# EAGLE schematic EEZ PSU consolidated r5B13a (EAGLE 6.1), part 2 of 2
## Sheet 11 of 12: Reset, load temp, digital input
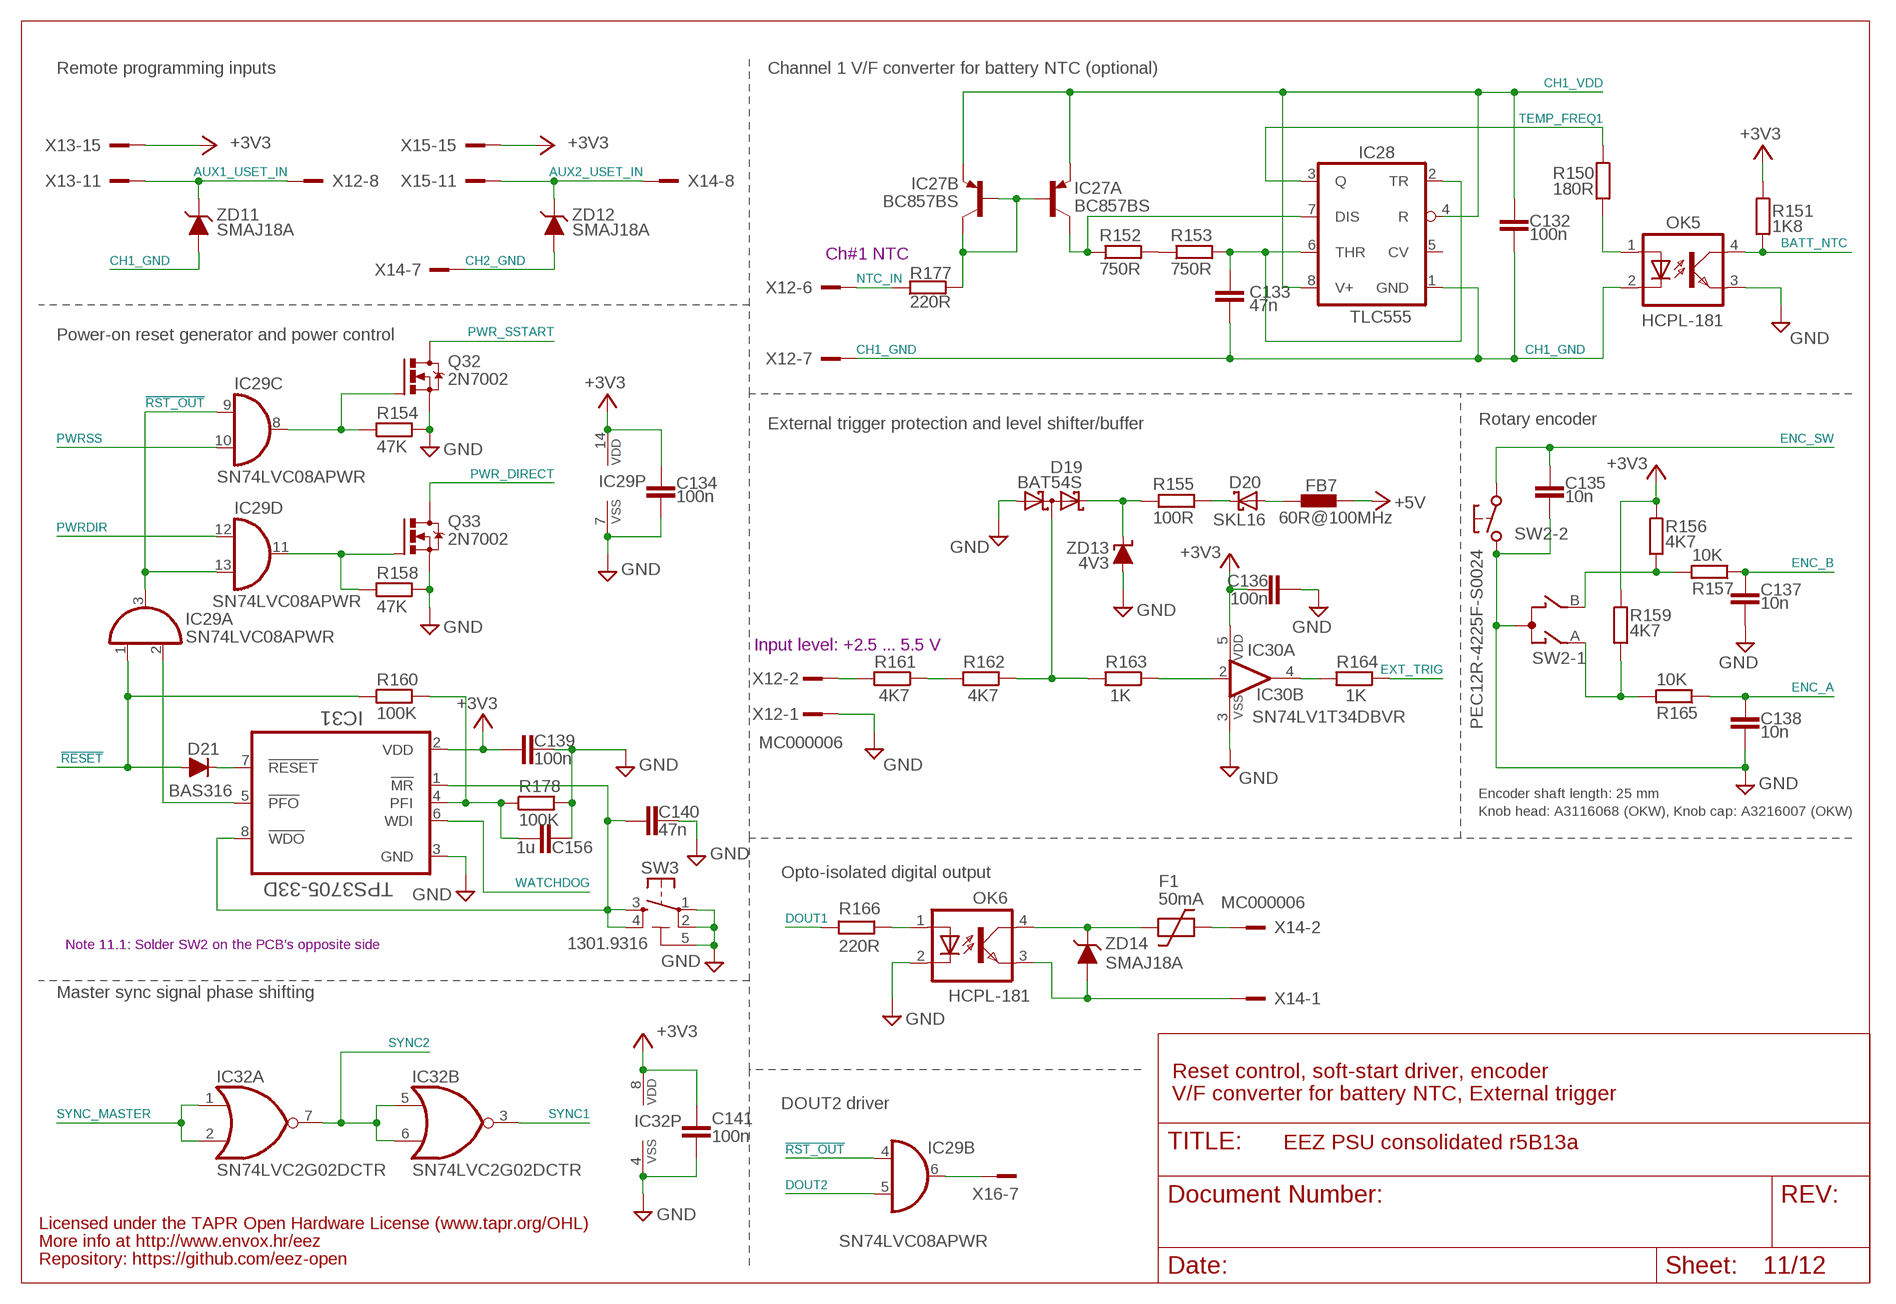
[diagram p10: schematic, sheet 11]

### Parts
C132  100n  C-EUC0603  [C0603]
C133  47n  C-EUC0805  [C0805]
C134  100n  C-EUC0603  [C0603]
C135  10n  C-EUC0805  [C0805]
C136  100n  C-EUC0603  [C0603]
C137  10n  C-EUC0805  [C0805]
C138  10n  C-EUC0805  [C0805]
C139  100n  C-EUC0603  [C0603]
C140  47n  C-EUC0805  [C0805]
C141  100n  C-EUC0603  [C0603]
C156  1u  C-EUC0805  [C0805]
D19  BAT54S  [SOT23]
D20  SKL16  SCHOTTKYSOD123  [SOD123]
D21  BAS316  DIODESOD323R  [SOD323-R]
F1  50mA  FUSE_RESETTABLE21210  [F1210]
FB7  60R@100MHz  FERRITE_BEAD0603  [BEAD0603]
IC27  BC857BS  [SOT65P210X110-6N]
IC28  TLC555  LM555SOIC8  [SOIC127P600X175-8N]
IC29  SN74LVC08APWR  [SOP65P640X120-14N]
IC30  SN74LV1T34DBVR  SN74LV1T34  [SOT95P280X145-5N]
IC31  TPS3705-33D  TPS3705XX  [SOIC127P600X175-8N]
IC32  SN74LVC2G02DCTR  [SOP65P400X130-8N]
OK5  HCPL-181  [HCPL-181]
OK6  HCPL-181  [HCPL-181]
Q32  2N7002  [SOT103P240X110-3N]
Q33  2N7002  [SOT103P240X110-3N]
R150  180R  R-EU_R0805  [R0805]
R151  1K8  R-EU_R0805  [R0805]
R152  750R  R-EU_R0805  [R0805]
R153  750R  R-EU_R0805  [R0805]
R154  47K  R-EU_R0805  [R0805]
R155  100R  R-EU_R0805  [R0805]
R156  4K7  R-EU_R0805  [R0805]
R157  10K  R-EU_R0805  [R0805]
R158  47K  R-EU_R0805  [R0805]
R159  4K7  R-EU_R0805  [R0805]
R160  100K  R-EU_R0805  [R0805]
R161  4K7  R-EU_R0805  [R0805]
R162  4K7  R-EU_R0805  [R0805]
R163  1K  R-EU_R0805  [R0805]
R164  1K  R-EU_R0805  [R0805]
R165  10K  R-EU_R0805  [R0805]
R166  220R  R-EU_R0805  [R0805]
R177  220R  R-EU_R0805  [R0805]
R178  100K  R-EU_R0805  [R0805]
SW2  PEC12R-4225F-S0024  ENCODER_SW  [EC12E_SW]
SW3  1301.9316  TACT_SW  [TACTM-6XN]
ZD11  SMAJ18A  PSMAXX  [DO214AC]
ZD12  SMAJ18A  PSMAXX  [DO214AC]
ZD13  4V3  ZENER-DIODEMINIMELF  [MINIMELF]
ZD14  SMAJ18A  PSMAXX  [DO214AC]

### Nets
!MR: C140.2 IC31.1(!MR) IC31.8(!WDO) SW3.3 SW3.4
!RESET: D21.A IC29.1(A:I0) R160.1 ; also sheet 9,10
!RST_OUT: IC29.3(A:O) IC29.4(B:I0) IC29.9(C:I0) IC29.13(D:I1)
+3V3: C134.2 C136.1 C139.2 C141.1 IC29.14(P:VDD) IC30.5(B:VDD) IC31.2(VDD) IC32.8(P:VDD) R151.1 R156.1 R159.1 X13.15 X15.15 ; also sheet 8,9,10,12
+5V: FB7.P$1 ; also sheet 2,3,4,5,6,7,8,9,10
AUX1_USET_IN: X12.8 X12.8.1 X13.11 ZD11.C
AUX2_USET_IN: X14.8 X14.8.1 X15.11 ZD12.C
BATT_NTC: OK5.4(COL) R151.2 ; also sheet 9
CH1_GND: C132.2 C133.1 IC28.1(GND) OK5.2(C) X12.7 X12.7.1 ZD11.A ; also sheet 9
CH1_VDD: C132.1 IC27.1(A:E) IC27.4(B:E) IC28.4(R) IC28.8(V+) ; also sheet 9
CH2_GND: X14.7 X14.7.1 ZD12.A ; also sheet 9
DOUT1: R166.1 ; also sheet 9
DOUT2: IC29.5(B:I1) ; also sheet 9
ENC_A: C138.1 R165.1 ; also sheet 9
ENC_B: C137.2 R157.1 ; also sheet 9
ENC_SW: C135.2 SW2.D ; also sheet 9
EOUT_A: R159.2 R165.2 SW2.A(-1:A)
EOUT_B: R156.2 R157.2 SW2.B(-1:B)
EXT_TRIG: R164.1 ; also sheet 9
GND [gnd]: C134.1 C135.1 C136.2 C137.1 C138.2 C139.1 C140.1 C141.2 C156.2 D19.1(A1) IC29.7(P:VSS) IC30.3(B:VSS) IC31.3(GND) IC32.4(P:VSS) OK5.3(EMIT) OK6.2(C) Q32.2(S) Q33.2(S) R154.2 R158.2 R178.2 SW2.C(-1:C) SW2.E(-2:S) SW2.GND1(-1:C) SW2.GND2(-1:C) SW3.1 SW3.2 SW3.5(5-GND) X12.1 X12.1.1 ZD13.A ; also sheet 1,2,3,4,5,6,7,8,9,10,12
N$46: F1.2 X14.2 X14.2.1
N$59: IC27.2(A:B) IC27.3(B:C) IC27.5(B:B) R177.2
N$82: IC29.8(C:O) Q32.1(G) R154.1
N$135: IC29.6(B:O) X16.7
N$136: C133.2 IC28.2(TR) IC28.6(THR) R153.2
N$137: IC27.6(A:C) IC28.7(DIS) R152.1
N$138: OK5.1(A) R150.2
N$139: D19.3(C1A2) R162.1 R163.2
N$140: IC30.2(A:I) R163.1
N$141: IC30.4(A:O) R164.2
N$142: R161.2 X12.2 X12.2.1
N$144: D19.2(C2) R155.1 ZD13.C
N$148: D20.C R155.2
N$149: D20.A FB7.P$2
N$151: C156.1 IC31.4(PFI) R160.2 R178.1
N$154: D21.C IC31.7(!RESET)
N$164: R161.1 R162.2
N$172: R152.2 R153.1
N$182: OK6.1(A) R166.2
N$185: IC29.2(A:I1) IC31.5(!PFO)
N$187: F1.1 OK6.4(COL) ZD14.C
N$188: OK6.3(EMIT) X14.1 X14.1.1 ZD14.A
NTC_IN: R177.1 X12.6 X12.6.1
PWR_DIRECT: Q33.3(D) ; also sheet 9
PWR_EN: IC29.11(D:O) Q33.1(G) R158.1
PWR_SSTART: Q32.3(D) ; also sheet 9
PWRDIR: IC29.12(D:I0) ; also sheet 9
PWRSS: IC29.10(C:I1) ; also sheet 9
SYNC1: IC32.3(B:O) ; also sheet 9
SYNC2: IC32.5(B:I0) IC32.6(B:I1) IC32.7(A:O) ; also sheet 9
SYNC_MASTER: IC32.1(A:I0) IC32.2(A:I1) ; also sheet 9
TEMP_FREQ1: IC28.3(Q) R150.1
WATCHDOG: IC31.6(WDI) ; also sheet 9
Unconnected: IC28.5(CV)

### Notes on the sheet
- Remote programming inputs | Channel 1 V/F converter for battery NTC (optional)
- Ch#1 NTC
- Power-on reset generator and power control
- External trigger protection and level shifter/buffer | Rotary encoder
- Input level: +2.5 ... 5.5 V
- Encoder shaft length: 25 mm
- Knob head: A3116068 (OKW), Knob cap: A3216007 (OKW)
- Opto-isolated digital output
- Note 11.1: Solder SW2 on the PCB's opposite side
- Master sync signal phase shifting
- Reset control, soft-start driver, encoder
- V/F converter for battery NTC, External trigger
- DOUT2 driver
- Licensed under the TAPR Open Hardware License (www.tapr.org/OHL)
- More info at http://www.envox.hr/eez
- Repository: https://github.com/eez-open

## Sheet 12 of 12
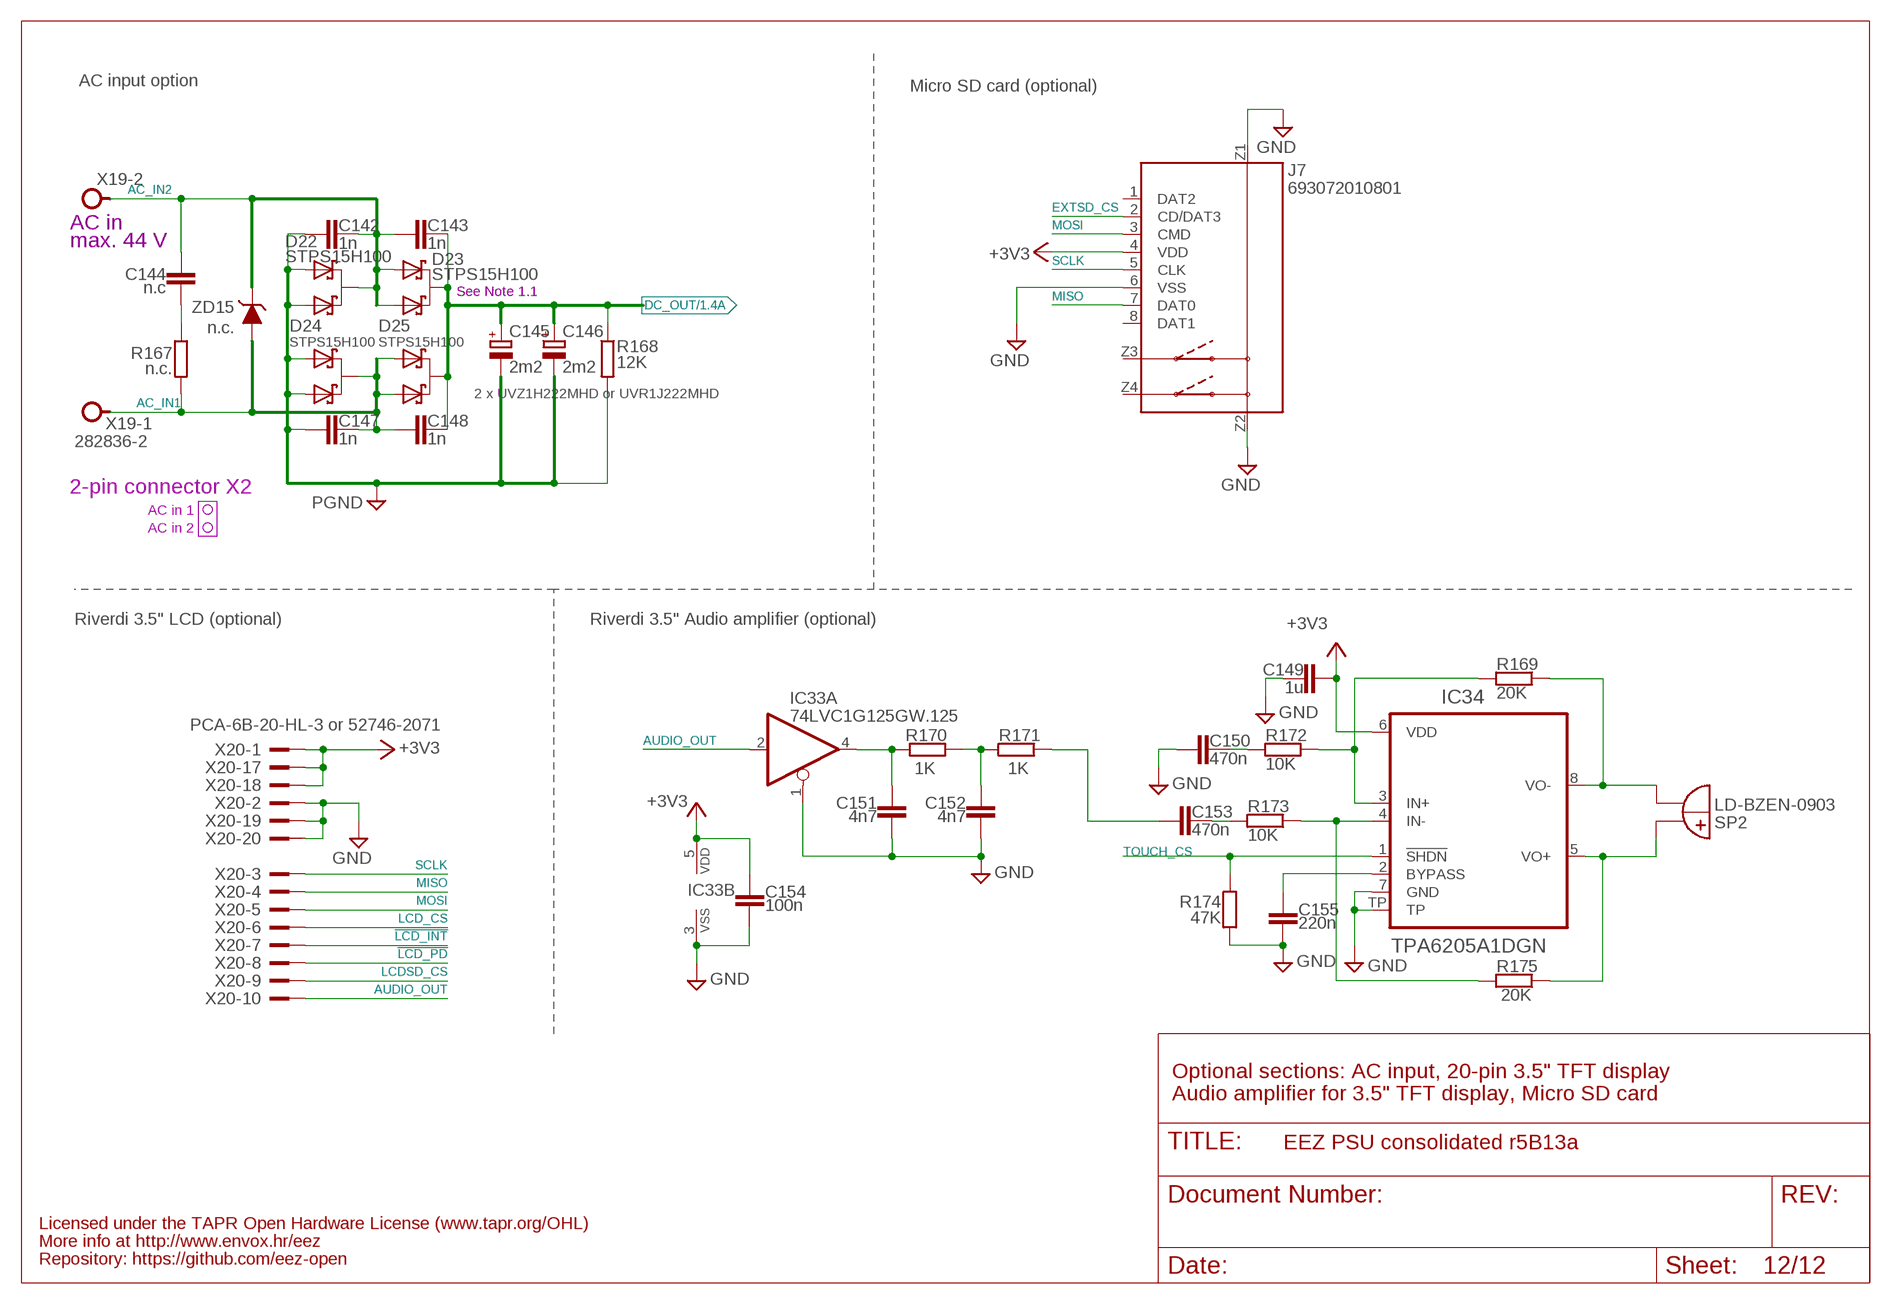
[diagram p11: schematic, sheet 12]

### Parts
C142  1n  C-EUC1206  [C1206]
C143  1n  C-EUC1206  [C1206]
C144  n.c  C-EUC1206  [C1206]
C145  2m2  ECAP7.5G_18MM  [ECAP7.5/18]
C146  2m2  ECAP7.5G_18MM  [ECAP7.5/18]
C147  1n  C-EUC1206  [C1206]
C148  1n  C-EUC1206  [C1206]
C149  1u  C-EUC0805  [C0805]
C150  470n  C-EUC0805  [C0805]
C151  4n7  C-EUC0805  [C0805]
C152  4n7  C-EUC0805  [C0805]
C153  470n  C-EUC0805  [C0805]
C154  100n  C-EUC0603  [C0603]
C155  220n  C-EUC0805  [C0805]
D22  STPS15H100  VS-6CWQ06FNPBF  [TO252]
D23  STPS15H100  VS-6CWQ06FNPBF  [TO252]
D24  STPS15H100  VS-6CWQ06FNPBF  [TO252]
D25  STPS15H100  VS-6CWQ06FNPBF  [TO252]
IC33  74LVC1G125GW.125  74LVC1G125TSSOP5  [SOT65P210X110-5N]
IC34  TPA6205A1DGN  TPA6205  [SOP65P490X110-9N]
J7  693072010801  [693072010801]
R167  n.c.  R-EU_R1206  [R1206]
R168  12K  R-EU_R1206  [R1206]
R169  20K  R-EU_R0805  [R0805]
R170  1K  R-EU_R0805  [R0805]
R171  1K  R-EU_R0805  [R0805]
R172  10K  R-EU_R0805  [R0805]
R173  10K  R-EU_R0805  [R0805]
R174  47K  R-EU_R0805  [R0805]
R175  20K  R-EU_R0805  [R0805]
SP2  LD-BZEN-0903  BUZZER-2  [LD-BZEN-0903]
X19  282836-2  TBLOCK5.0_2A  [TBLOCK5.0_2]
X20  PCA-6B-20-HL-3 or 52746-2071  WR-FPC_68712014522_ROTATED  [FPC-20_ROTATED]
ZD15  n.c.  P6SMB68A  [DO214AA]

### Nets
!LCD_INT: X20.7 ; also sheet 9
!LCD_PD: X20.8 ; also sheet 9
+3V3: C149.2 C154.2 IC33.5(B:VDD) IC34.6(VDD) J7.4(VDD) X20.1 X20.17 X20.18 ; also sheet 8,9,10,11
AC_IN1: C147.1 C148.2 D24.3(C) D25.1(A1) D25.2(A2) R167.2 X19.1 ZD15.A
AC_IN2: C142.1 C143.2 C144.1 D22.3(C) D23.1(A1) D23.2(A2) X19.2 ZD15.C
AUDIO_OUT: IC33.2(A:I) X20.10
DC_OUT: C143.1 C145.+ C146.+ C148.1 D23.3(C) D25.3(C) R168.1 ; also sheet 1,2,3
EXTSD_CS: J7.2(CD/DAT3) ; also sheet 9
GND [gnd]: C142.2 C145.- C146.- C147.2 C149.1 C150.2 C151.2 C152.2 C154.1 C155.1 D22.1(A1) D22.2(A2) D24.1(A1) D24.2(A2) IC33.1(A:OE) IC33.3(B:VSS) IC34.7(GND) IC34.TP J7.6(VSS) J7.Z1 J7.Z2 R168.2 R174.2 X20.2 X20.19 X20.20 ; supply symbol labelled PGND ; also sheet 1,2,3,4,5,6,7,8,9,10,11
LCD_CS: X20.6 ; also sheet 9,10
LCDSD_CS: X20.9 ; also sheet 9,10
MISO: J7.7(DAT0) X20.4 ; also sheet 9,10
MOSI: J7.3(CMD) X20.5 ; also sheet 8,9,10
N$4: IC34.5(VO+) R175.1 SP2.+B(+)
N$8: C144.2 R167.1
N$166: IC34.8(VO-) R169.1 SP2.-B(-)
N$171: IC34.4(IN-) R173.1 R175.2
N$181: IC34.3(IN+) R169.2 R172.1
N$193: C150.1 R172.2
N$194: C155.2 IC34.2(BYPASS)
N$195: C153.1 R173.2
N$197: C153.2 R171.1
N$198: C152.1 R170.1 R171.2
N$199: C151.1 IC33.4(A:O) R170.2
SCLK: J7.5(CLK) X20.3 ; also sheet 8,9,10
TOUCH_CS: IC34.1(!SHDN) R174.1 ; also sheet 9,10
Unconnected: J7.1(DAT2) J7.8(DAT1) J7.Z3 J7.Z4 X20.11 X20.12 X20.13 X20.14 X20.15 X20.16

### Notes on the sheet
- AC input option
- Micro SD card (optional)
- AC in
- max. 44 V
- See Note 1.1
- 2 x UVZ1H222MHD or UVR1J222MHD
- 2-pin connector X2
- AC in 1
- AC in 2
- Riverdi 3.5" LCD (optional) | Riverdi 3.5" Audio amplifier (optional)
- Optional sections: AC input, 20-pin 3.5" TFT display
- Audio amplifier for 3.5" TFT display, Micro SD card
- Licensed under the TAPR Open Hardware License (www.tapr.org/OHL)
- More info at http://www.envox.hr/eez
- Repository: https://github.com/eez-open

## Library data of the parts
C1 C2 C4-C12 C14 C16-C20 C22 C24-C26 C28-C30 C32-C56 C58-C76 C79 C81-C85 C87 C88 C90-C93 C95 C97-C102 C104 C104A C106-C109 C109A C110 C111 C113-C128 C131-C144 C147-C156 = rcl:C-EU: CAPACITOR, European symbol
C3 C86 C89 C94 C96 = Panasonic-EEEFK_EEEFP:EEE-: Aluminum Electrolytic Capacitors,Surface Mount Type; MPN: EEE-FK1J220P; OC_FARNELL: 9696016; OC_NEWARK: 96K9400; PACKAGE: CASE-E; SUPPLIER: PANASONIC; TOLERANCE: ±20 %; VALUE: 22UF; VOLTAGERATING: 63V
C13 = Panasonic-EEEFK_EEEFP:EEE-: Aluminum Electrolytic Capacitors,Surface Mount Type; MPN: EEE-FK1J470P; OC_FARNELL: 9696032; OC_NEWARK: 96K9403; PACKAGE: CASE-F; SUPPLIER: PANASONIC; TOLERANCE: ±20 %; VALUE: 47UF; VOLTAGERATING: 63 V
C15 C21 C23 C31 C57 C77 C78 C80 C103 C105 C129 C130 C145 C146 = EEZ_Lib1:ECAP
C27 = rcl:CPOL-EU: POLARIZED CAPACITOR, European symbol
C112 = EEZ_Lib1:SUPER_CAP: Electric Double Layer Supercapacitors, Type EDL Vertical - Manufacturer Part No: EDLSG105V5R5C Farnell: 2113011 Horizontal - Manufacturer Part No: EDLSG105H5R5C Farnell: 1364209, 9697497
D1 D11 D20 = EEZ_Lib1:SCHOTTKY
D2-D10 D13 D16 D21 = EEZ_Lib1:DIODE
D12 D14 D15 D18 = diode:DIODE-: DIODE
D17 = MyLib6:DIODE
D19 = diode:BAT54S: Schottky Diodes Pin connection corrected 2011-05-04 Source: Fairchild .. BAT54.pdf
D22-D25 = EEZ_Lib1:VS-6CWQ06FNPBF: Schottky Rectifier, 2 x 3.5 A
F1 = EEZ_Lib1:FUSE_RESETTABLE2
FB1-FB3 FB7 = EEZ_Lib1:FERRITE_BEAD: FAIR-RITE - 2506033007Y3 - FERRITE BEAD, 0.04OHM, 3A, 0603 Farnell: 2112873
FB4-FB6 = MyLib6:FERRITE_BEAD: FAIR-RITE - 2506033007Y3 - FERRITE BEAD, 0.04OHM, 3A, 0603 Farnell: 2112873
FM1-FM6 = EEZ_Lib1:FIDUCIAL: Fiducial mark for pick and place automation
IC1 = EEZ_Lib1:LTC3864: 60V Low Iq Step-Down DC/DC Controller with 100% Duty Cycle Capability
IC2 = EEZ_Lib1:LP2951: LP2950-N/LP2951-N Series of Adjustable Micropower Voltage Regulators
IC3 = EEZ_Lib1:TL783CKTTR: REG, HI-VOLT, ADJ, D2PAK-3; MPN: TL783CKTTR; OC_FARNELL: 2075436; OC_NEWARK: 18M3193; PACKAGE: D2PAK-3; SUPPLIER: TEXAS INSTRUMENTS
IC4 = EEZ_Lib1:LTC3260: Low Noise Dual Supply Inverting Charge Pump
IC5 IC6 = EEZ_Lib1:TL072
IC7 = EEZ_Lib1:OP27GSZ: Low Noise, Precision Operational Amplifier
IC8 = EEZ_Lib1:MCP23S17-E/SS: 16-Bit I/O Expander with Serial Interface; FARNELL: 1467675; TME: MCP23S17-E/SS
IC9 = EEZ_Lib1:REF50XX: Low-Noise (3μVpp/V), Very Low Drift (max. 8ppm/°C), Precision Voltage Reference Pin compatible with REF2 Farnell: 1439628
IC10 = EEZ_Lib1:DAC8552_DGK_8
IC12 = EEZ_Lib1:TS5A9411DCKT: 10-Ω SPDT ANALOG SWITCH SINGLE-CHANNEL 2:1 MULTIPLEXER/DEMULTIPLEXER; FARNELL: 1755582
IC13 = EEZ_Lib1:ADS1120: Low-Power, Low-Noise, 16-Bit, Analog-to-Digital Converter for Small-Signal Sensors Farnell: 2402249
IC14 = EEZ_Lib1:LM339: Low Power Low Offset Voltage Quad Comparators with open collector; LM139/LM239/LM339/LM2901/LM3302
IC15 = EEZ_Lib1:TPD4E002: Low-Capacitance 4-Channel +/-15-kV ESD Protection Array for High-Speed Data Interfaces
IC16 = EEZ_Lib1:TPD2E001: Low-Capacitance 2-Channel +/-15 kV ESD-Protection Array for High-Speed Data Interfaces
IC17 = MyLib6:ADUM3160BRWZ: Full/Low Speed 2.5 kV USB Digital Isolator
IC18 = MyLib6:TLC5925IDBQR: CONSTANT-CURRENT LED SINK DRIVER; MPN: TLC5925IDBQR; OC_FARNELL: 1694438; OC_NEWARK: 46P3784; PACKAGE: SOP-24; SUPPLIER: Texas Instruments
IC19 IC23 = EEZ_Lib1:SI8641: Low power 4-ch digital isolator (3+1) Farnell: 2423288
IC20 IC21 = EEZ_Lib1:SI8651: Low power 5-ch digital isolator (4+1); FARNELL: 2423323
IC22 = v-reg:LD117A?*: Low drop fixed and adjustable positive voltage regulators 1 A Source: http://www.st.com/stonline/products/literature/ds/7194/ld1117axx.pdf
IC24 = MyLib6:PCA21125: SPI-bus Real-Time Clock and calendar Farnell: 2400445
IC25 = MyLib6:AT25XXX: SPI Serial EEPROM, Supports SPI Modes 0 (0,0) and 3 (1,1) Atmel AT25128 128K (16 384 x 8) Farnell: 2345601 Atmel AT25256 256K (32 768 x 8) Farnell: 1841577 Atmel AT25512 512K (65 536 x 8) Farnell: 2345608
IC26 = EEZ_Lib1:W5500: The W5500 chip is a Hardwired TCP/IP embedded Ethernet controller that enables easier internet connection for embedded systems using SPI (Serial Peripheral Interface). Case TQFP48; TME: W5500
IC27 = MyLib6:BC857BS: PNP general purpose dual transistor
IC28 = MyLib6:LM555
IC29 = EEZ_Lib1:SN74LVC08APWR: QUADRUPLE 2-INPUT POSITIVE-AND GATES; FARNELL: 1102978
IC30 = EEZ_Lib1:SN74LV1T34: Single Power Supply Single Buffer GATE CMOS Logic Level Shifter; FARNELL: 2499914
IC31 = EEZ_Lib1:TPS3705XX: Processor supervisory circuit with power-fail; FARNELL: 2296066
IC32 = EEZ_Lib1:SN74LVC2G02DCTR: NOR Gate, LVC Family, 2 Input, 32 mA, 1.65V to 5.5V, SSOP-8
IC33 = EEZ_Lib1:74LVC1G125: Bus buffer/line driver, 3-state
IC34 = EEZ_Lib1:TPA6205: 1.25-W Mono Fully Differential Audio Power Amplifier
J1 J3-J6 = EEZ_Lib1:BINDING_POST
J2 = EEZ_Lib1:PCB_TAB
J7 = EEZ_Lib1:693072010801
JP1-JP4 = EEZ_Lib1:JP3-CUT: 2-way SMT jumper with one position connected
JP9 JP10 = EEZ_Lib1:JUMPER-3PIN
K_DOUT K_PAR K_SER = EEZ_Lib1:RELAY_RT314012
K_S1 K_S2 = relay:G6K: Low Signal Relay oeiwcsnts1.omron.com/.. D20G6K0100.pdf; MF: OMRON COMPONENTS USA; MPN: G6K-2F DC24; OC_FARNELL: 1690427; OC_NEWARK: 36K7467
KK1 = EEZ_Lib1:SK145: FISCHER ELEKTRONIK SK 145/37,5 STS-220 Heat Sink, TO-220, TO-218, TO-220, TO-247, TO-248, 12 °C/W, 29 mm, 12 mm
L1 = EEZ_Lib1:RN112
L2 = WE-HCI:WE-HCI: SMD-Flat Wire High Current Inductor WE-HCI - Flat wire coil for lower losses at high frequency ranges - Low leakage field - Extremely low profile design - Current loading up to 40 A - Magnetically shielded -- Graphic cards -- Laptops -- Motherboards -- High current switching regulators -- Polyphase-switching regulators -- industrial computers; MPN: 7443551331; OC_FARNELL: 2211631; OC_NEWARK: 44W4647; PACKAGE: 1365; SUPPLIER: Würth Elektronik eiSos GmbH
L3 L4 = EEZ_Lib1:IHLP-2020BZ-11: Low Profile, High Current IHLP® Inductors
L5 = EEZ_Lib1:DE0704: Ferrocore SMD power coil 7.3 x 7.3 mm
LCD1 = EEZ_Lib1:LCD_TFT_320QVT: 3.2" 320x240 TFT Module Display Touch Panel with PCB 262K Colors IC SSD1289
LED_CC1 LED_CC2 LED_CV1 LED_CV2 LED_O1 LED_O2 LED_PROG1 LED_PROG2 LED_PWR LED_S1 LED_S2 LED_SP = EEZ_Lib1:LED
MCU = EEZ_Lib1:ARDUINO_MEGA+ICSP
NTC1 = EEZ_Lib1:NTC
OK1 = EEZ_Lib1:MOC305X: 6-pin DIP Random-phase Optoisolators Triac Drivers (600V Peak)
OK2 = optocoupler:MOC30*: 6-Pin DIP Zero-Cross Optoisolators Triac Driver Output (250/400 Volt Peak) Source: http://www.fairchildsemi.com/ds/MO/MOC3043-M.pdf; MF: FAIRCHILD SEMICONDUCTOR; MPN: MOC3033S-M; OC_FARNELL: unknown; OC_NEWARK: 05C2878
OK3-OK6 = EEZ_Lib1:HCPL-181: Phototransistor Optocoupler SMD Mini-Flat Type
Q1 Q7 = EEZ_Lib1:P-MOSFET: HEXFET Power MosFet Source: http://www.irf.com/
Q2 Q5 Q9 Q10 Q18 = transistor:*-PNP-: PNP Transistror
Q3 Q16 Q24 Q34 = EEZ_Lib1:2N7002: N-CHANNEL ENHANCEMENT MODE FIELD EFFECT TRANSISTOR; MPN: 2N7002-7-F; OC_FARNELL: 1713823; OC_NEWARK: 25R5679; PACKAGE: SOT-23-3; SUPPLIER: DIODES INC.
Q4 = EEZ_Lib1:IRFP240: HEXFET Power MosFet Source: http://www.irf.com/
Q6 Q8 = EEZ_Lib1:BCP56: Low power NPN Transistor, Vceo=80V, Ic=1A, SOT-223
Q11 Q12 Q17 Q19 Q20 = transistor:*-NPN-: NPN Transistror BF959 corrected 2008.03.06
Q13 Q23 = transistor-power:N-HEXFET-2D_?-*: HEXFET® Power MOSFET 2 Drain connects http://www.irf.com/product-info/datasheets/data/irll014n.pdf
Q14 = EEZ_Lib1:N-MOSFET
Q15 = EEZ_Lib1:IRLML2246TRPBF: HEXFET Power MOSFET (-20V, -2.6A); MPN: IRLML2246TRPBF; OC_FARNELL: 1888166; OC_NEWARK: 40T7450; PACKAGE: SOT-3; SUPPLIER: International Rectifier; TME: IRLML2246TRPBF
Q21 Q22 = triac:BTA26: 25A TRIAC Source: http://www.st.com/stonline/products/literature/ds/7470.pdf
Q25 Q30 Q32 Q33 = MyLib6:2N7002: N-CHANNEL ENHANCEMENT MODE FIELD EFFECT TRANSISTOR; MPN: 2N7002-7-F; OC_FARNELL: 1713823; OC_NEWARK: 25R5679; PACKAGE: SOT-23-3; SUPPLIER: DIODES INC.
Q26-Q29 Q31 = MyLib6:IRLML2246TRPBF: HEXFET Power MOSFET (-20V, -2.6A); MPN: IRLML2246TRPBF; OC_FARNELL: 1888166; OC_NEWARK: 40T7450; PACKAGE: SOT-3; SUPPLIER: International Rectifier; TME: IRLML2246TRPBF
R2-R65 R65B R66-R77 R78A R78B R79-R102 R104-R136 R136A R137-R140 R140A R141-R180 = rcl:R-EU_: RESISTOR, European symbol
R65A = EEZ_Lib1:R-EU_4WIRE
R103 = EEZ_Lib1:R_EU: RESISTOR - European symbol
RN1 RN2 = EEZ_Lib1:R_ARRAY4: 1206 four resistor array
SAR1 = EEZ_Lib1:SAR: EPCOS surge arrester EF470X Farnell: 1886596
SH1-SH3 = EEZ_Lib1:SHORT
SP1 SP2 = EEZ_Lib1:BUZZER: Loudity LD-BZEN-0903 Sound transducer: electromagnetic; without built-in generator; TME: LD-BZEN-0903
SW1 = switch:M9040P: TOGGLE SWITCH Marquardt
SW2 = EEZ_Lib1:ENCODER_SW
SW3 = EEZ_Lib1:TACT_SW
TR1 = EEZ_Lib1:AC_DC_ADAPTER_DUAL
VAR1-VAR4 = EEZ_Lib1:VARISTOR: EPCOS - B72220S0251K101 - VARISTOR, 140J, 250VAC Farnell: 1004357
X1 = EEZ_Lib1:MINIFIT_39301039: MOLEX socket; wire-board; male; Mini-Fit Jr; 4.2mm; PIN:3; THT; PCB snap
X2 = EEZ_Lib1:SSW-113-02-T-D-RA: Samtec SSW-113-02-T-D-RA Receptacle, 2.54MM, RA, 26-way; FARNELL: 1805583; TME: ZL263-26DG
X3 = EEZ_Lib1:MINIFIT_6659-5: MOLEX 39303055 Wire-To-Board Connector, Single In Line, Mini-Fit Jr 5569 Series, 5 Contacts, Plug, 4.2 mm
X4 = con-molex:22-23-2031: .100" (2.54mm) Center Header - 3 Pin; MF: MOLEX; MPN: 22-23-2031; OC_FARNELL: 1462950; OC_NEWARK: 30C0862
X5 X16 = EEZ_Lib1:IDC-10PIN: 10-pin IDC socket male, straight; TME: T821-1-10-S1
X6 = EEZ_Lib1:TBLOCK5.0_3A
X7 = EEZ_Lib1:RJ45-VERT: AMPHENOL LMJ2138812S0LOT6C Socket; RJ45; PIN:8; vertical, shielded, with LED and trafo; TME: LMJ2138812S0LOT6C
X8 X18 = EEZ_Lib1:HEADER_8-PIN
X9 X10 = con-samtec:SSW-105-02-S-S: THROUGH-HOLE .025" SQ POST SOCKET Source: Samtec SSW.pdf; MPN: SSW-105-02-S-S; OC_FARNELL: unknown; OC_NEWARK: 11P9399
X11 = con-kycon:KUSBVX-BS1N: USB B-type Receptacle Vertical, 4 Position, Through Hole Source: Sibalco Kycon KUSBVX-BS1N-xxx.pdf
X12 X14 = EEZ_Lib1:MC000006: Wire-To-Board Terminal Block, 8, 150 V, 6 A, 26 AWG, 20 AWG No. of Positions:8; Rated Voltage:150V; Rated Current:6A; FARNELL: 2007972
X13 X15 = EEZ_Lib1:TSW-113-07-F-D: Samtec TSW-110-07-F-D Header, 2.54MM, THT, 26-way; FARNELL: 2025182
X17 = con-molex:22-23-2021: .100" (2.54mm) Center Header - 2 Pin; MF: MOLEX; MPN: 22-23-2021; OC_FARNELL: 1462926; OC_NEWARK: 25C3832
X19 = EEZ_Lib1:TBLOCK5.0_2A
X20 = EEZ_Lib1:WR-FPC_68712014522: 20-pin 0.5mm SMT ZIF Horizontal Bottom Contact WR-FPC
Y1 Y2 = MyLib6:XTAL
ZD1 ZD15 = EEZ_Lib1:P6SMB68A: Transient Voltage Suppression Diodes, DO-214AA
ZD2 ZD3 ZD13 ZD16 ZD17 = EEZ_Lib1:ZENER-DIODE
ZD4 ZD5 = EEZ_Lib1:1.5KE-BIDIR
ZD6-ZD12 ZD14 = EEZ_Lib1:PSMAXX: Transient Voltage Suppressor, TVS, P4SMA Series, Unidirectional
ZD18 = EEZ_Lib1:SLVU2.8: 2.8Volts ESD Protection Devices

## Net classes
0 default: width 0.254 mm, drill 0.584 mm, clearance 0.254 mm
1 dgnd: width 0.254 mm, drill 0.584 mm, clearance 0.254 mm
2 gnd: width 0.254 mm, drill 0.584 mm, clearance 0.254 mm